# Altium schematic sheet 15 WIFI.SchDoc
size 420 x 297 mm
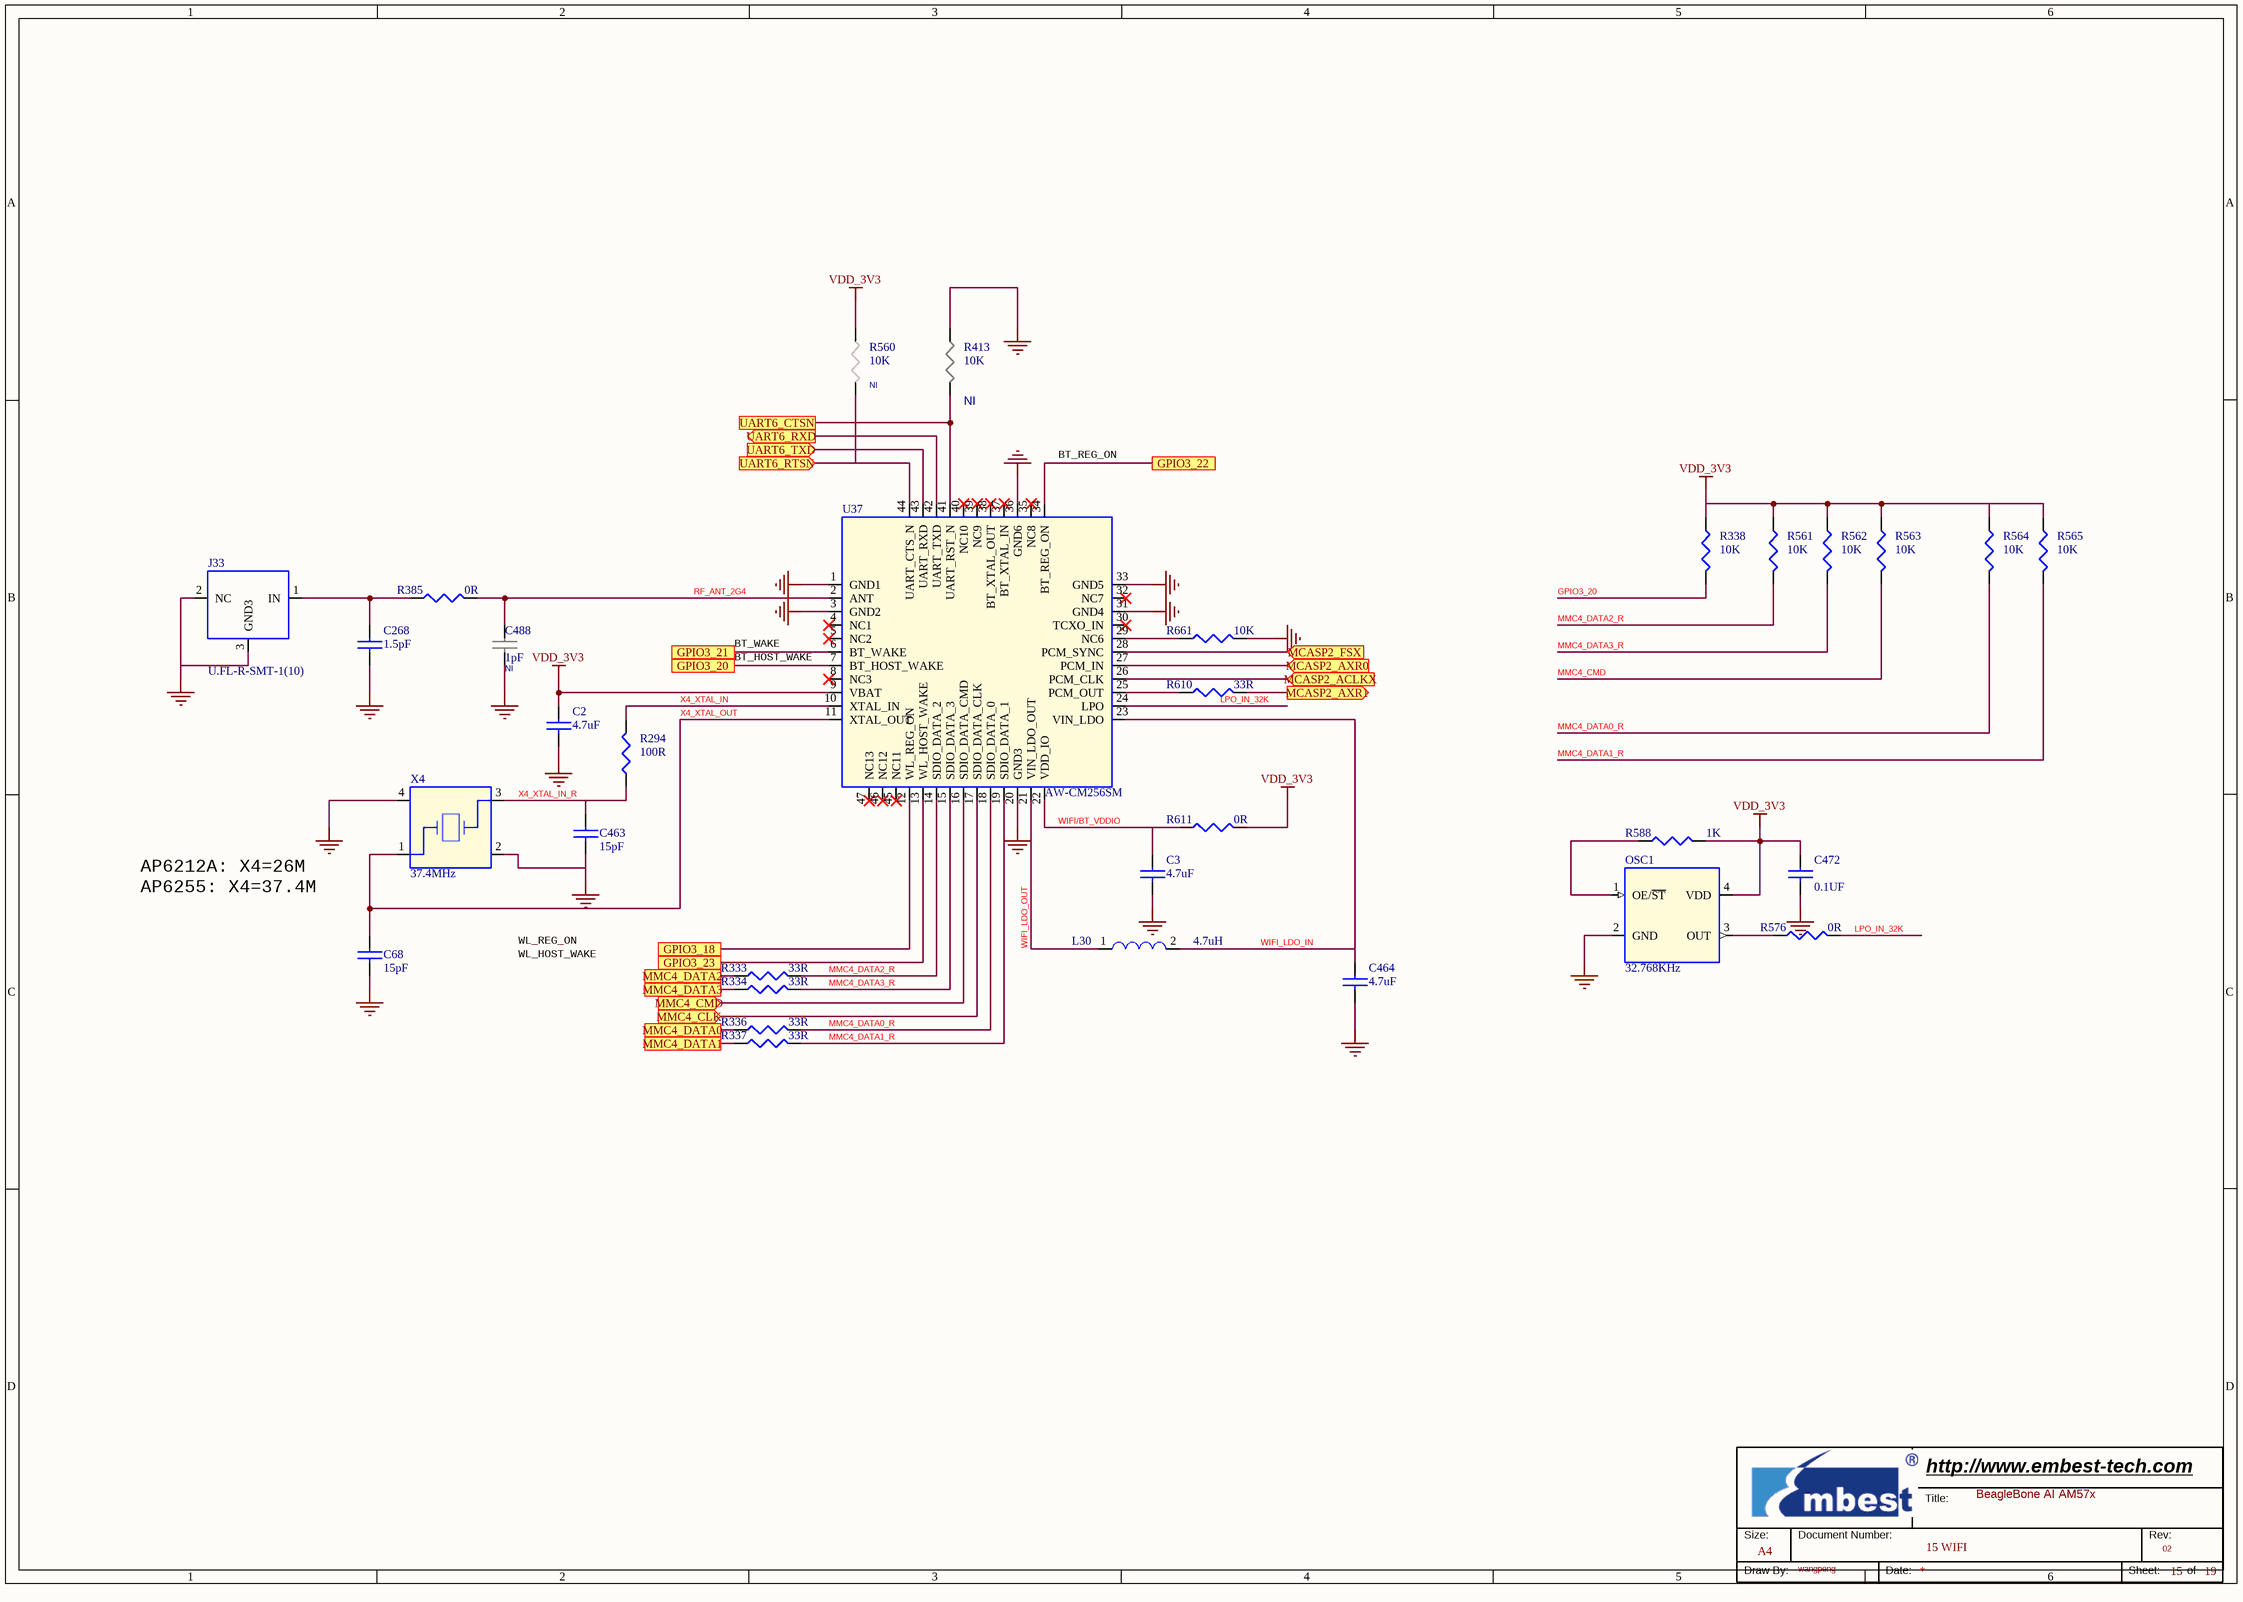
[diagram p0: 15 WIFI.SchDoc]

## Parts
*  Page Count: 19  Page Number: 15  Page Size: A4  Title: BeagleBone AI AM57x  RevCode: 02  Doc: 15 WIFI  Drawing: wangpeng  (hidden comment: Embest Title)  (graphical)
C2  4.7uF  [C0603]
C3  4.7uF  [C0603]
C68  15pF  [C0402]
C268  1.5pF  [C0402]
C463  15pF  [C0402]
C464  4.7uF  [C0603]
C472  0.1UF  [C0402]
C488  1pF  ASSY: NI  [C0402]
J33  U.FL-R-SMT-1(10)  [ANT3S_26X26]
L30  4.7uH  [L25X20]
OSC1  32.768KHz  [X4S25X20]
R294  100R  [R0402]
R333  33R  [R0402]
R334  33R  [R0402]
R336  33R  [R0402]
R337  33R  [R0402]
R338  10K  [R0402]
R385  0R  [R0402]
R413  10K  ASSY: NI  [R0402]
R560  10K  ASSY: NI  [R0402]
R561  10K  [R0402]
R562  10K  [R0402]
R563  10K  [R0402]
R564  10K  [R0402]
R565  10K  [R0402]
R576  0R  [R0402]
R588  1K  [R0402]
R610  33R  [R0402]
R611  0R  [R0402]
R661  10K  [R0402]
U37  AW-CM256SM  [WLBT90P1200X1200X160-47N]
X4  37.4MHz  [X4S16X12]

## Ports
GPIO3_18, GPIO3_20, GPIO3_21, GPIO3_22, GPIO3_23, MCASP2_ACLKX (in), MCASP2_AXR0 (in), MCASP2_AXR1 (out), MCASP2_FSX (in), MMC4_CLK (in), MMC4_CMD (in), MMC4_DATA0, MMC4_DATA1, MMC4_DATA2, MMC4_DATA3, UART6_CTSN, UART6_RTSN (in), UART6_RXD (out), UART6_TXD (in)

## Nets
GND: C2.2 C3.2 C68.2 C268.2 C463.2 C464.2 C472.2 C488.2 J33.2(NC) J33.3(GND3) OSC1.2(GND) R413.1 R661.2 U37.1(GND1) U37.3(GND2) U37.20(GND3) U37.31(GND4) U37.33(GND5) U37.36(GND6) X4.2 X4.4
VDD_3V3: C2.1 C472.1 OSC1.4(VDD) R338.1 R560.1 R561.1 R562.1 R563.1 R564.1 R565.1 R588.2 R611.2 U37.9(VBAT)
GPIO3_18: U37.12(WL_REG_ON) ; port GPIO3_18
GPIO3_20: R338.2
GPIO3_20: U37.7(BT_HOST_WAKE) ; port GPIO3_20  [a separate net that carries the same name]
GPIO3_21: U37.6(BT_WAKE) ; port GPIO3_21
GPIO3_22: U37.34(BT_REG_ON) ; port GPIO3_22
GPIO3_23: U37.13(WL_HOST_WAKE) ; port GPIO3_23
LPO_IN_32K: R576.2 U37.24(LPO)
MCASP2_ACLKX: U37.26(PCM_CLK) ; port MCASP2_ACLKX
MCASP2_AXR0: U37.27(PCM_IN) ; port MCASP2_AXR0
MCASP2_AXR1: R610.2 ; port MCASP2_AXR1
MCASP2_FSX: U37.28(PCM_SYNC) ; port MCASP2_FSX
MMC4_CLK: U37.17(SDIO_DATA_CLK) ; port MMC4_CLK
MMC4_CMD: R563.2
MMC4_CMD: U37.16(SDIO_DATA_CMD) ; port MMC4_CMD  [a separate net that carries the same name]
MMC4_DATA0: R336.1 ; port MMC4_DATA0
MMC4_DATA0_R: R336.2 R564.2 U37.18(SDIO_DATA_0)
MMC4_DATA1: R337.1 ; port MMC4_DATA1
MMC4_DATA1_R: R337.2 R565.2 U37.19(SDIO_DATA_1)
MMC4_DATA2: R333.1 ; port MMC4_DATA2
MMC4_DATA2_R: R333.2 R561.2 U37.14(SDIO_DATA_2)
MMC4_DATA3: R334.1 ; port MMC4_DATA3
MMC4_DATA3_R: R334.2 R562.2 U37.15(SDIO_DATA_3)
RF_ANT_2G4: C488.1 R385.2 U37.2(ANT)
UART6_CTSN: R413.2 U37.41(UART_RST_N) ; port UART6_CTSN
UART6_RTSN: R560.2 U37.44(UART_CTS_N) ; port UART6_RTSN
UART6_RXD: U37.42(UART_TXD) ; port UART6_RXD
UART6_TXD: U37.43(UART_RXD) ; port UART6_TXD
WIFI/BT_VDDIO: C3.1 R611.1 U37.22(VDD_IO)
WIFI_LDO_IN: C464.1 L30.2 U37.23(VIN_LDO)
WIFI_LDO_OUT: L30.1 U37.21(VIN_LDO_OUT)
X4_XTAL_IN: R294.2 U37.10(XTAL_IN)
X4_XTAL_IN_R: C463.1 R294.1 X4.3
X4_XTAL_OUT: C68.1 U37.11(XTAL_OUT) X4.1
NetC268_1: C268.1 J33.1(IN) R385.1
NetOSC1_1: OSC1.1(OE/~{ST}) R588.1
NetOSC1_3: OSC1.3(OUT) R576.1
NetR610_1: R610.1 U37.25(PCM_OUT)
NetR661_1: R661.1 U37.29(NC6)

Not connected (* = marked no-connect by the designer): U37 4(NC1)* 5(NC2)* 8(NC3)* 30(TCXO_IN)* 32(NC7)* 35(NC8)* 37(BT_XTAL_IN)* 38(BT_XTAL_OUT)* 39(NC9)* 40(NC10)* 45(NC11)* 46(NC12)* 47(NC13)*

## Notes on the sheet
- BT_REG_ON
- BT_WAKE
- (near U37) BT_HOST_WAKE
- AP6212A: X4=26M
  AP6255: X4=37.4M
- WL_REG_ON
- WL_HOST_WAKE
- (in symbol Embest Title) Title:; Size:; Document Number:; Rev:; Draw By:; Date:; Sheet:; of

## Library data of the parts
C2 = C: CAP,4.7UF,+/-10%,X5R,10V,SMD0603; Manufacturer Part Number: GRM188R61A475KE15D; Manufacturer: Murata; Embest PN: 1004001100126; Part Type: Ceramic Capacitor
C3 C464 = C: CAP,4.7UF,+/-10%,X5R,10V,SMD0603; Manufacturer: Murata; Manufacturer Part Number: GRM188R61A475KE15D; Embest PN: 1004001100126; Part Type: Ceramic Capacitor
C68 C463 = C: CAP,15pF,+/-2%,C0G,50V,SMD0402; Manufacturer Part Number: GRM1555C1H150GA01D; Manufacturer: Murata; Embest PN: 1004001100319; Datasheet: Y:\ÐÂK3ÏµÍ³ÎïÁÏdatasheet\[1003_1004]capacitor-resistor µçÈÝ¡¢µç×è\1004001100319 GRM1555C1H150GA01DMurata.pdf; Part Type: Ceramic Capacitor
C268 = C: Cap  Ceramic 1.5pF, +-0.25pF, 50V, C0G, 0402; Manufacturer: Murata; Manufacturer Part Number: GRM1555C1H1R5CA01D; Embest PN: 1004001100401; Part Type: Ceramic Capacitor
C472 = C: CAP,100NF,+/-10%,X7R,16V,SMD0402; Manufacturer Part Number: GRM155R71C104KA88D; Manufacturer: Murata; Embest PN: 1004001100047; Datasheet: Y:\ÐÂK3ÏµÍ³ÎïÁÏdatasheet\[1003_1004]capacitor-resistor µçÈÝ¡¢µç×è\1004001100047-GRM155R71C104KA88D.pdf; Part Type: Ceramic Capacitor
C488 = C: CAP,1.0PF,+/-0.1PF,50V,SMD0402,LowESR,High-Q type; Manufacturer Part Number: GJM1555C1H1R0BB01D; Manufacturer: Murata; Embest PN: 1004001100306; Datasheet: Y:\ÐÂK3ÏµÍ³ÎïÁÏdatasheet\[1003_1004]capacitor-resistor µçÈÝ¡¢µç×è\1004001100306 GJM1555C1H1R0BB01D murata.pdf; Part Type: Ceramic Capacitor
J33 = ANT3P: Connector,Coaxial Connector,U.FL-R-SMT-1,6GHZ,SMD,TR  U.FL-R-SMT-1(10) Packing for2,500 pcs/reel or U.FL-R-SMT-1(40) Packing for4,000 pcs/reel; Manufacturer: HIROSE; Embest PN: 1009019100014; Part Type: RF CONNECTOR; Manufacturer Part Number: U.FL-R-SMT-1(10); Datasheet: Y:\ÐÂK3ÏµÍ³ÎïÁÏdatasheet\[1009]connectors Á¬½ÓÆ÷\1009019100014 U.FL-R-SMT-1(10) hirose.pdf
L30 = L: Power Inductor,Magnetic shielded,4.7uH,1.05A,0.338ohm,2.5x2.0x1.2mm,SMD; Manufacturer: TDK; Manufacturer Part Number: VLS252012ET-4R7M; Embest PN: 1005004100057; Part Type: Power Inductor; Datasheet: Y:\ÐÂK3ÏµÍ³ÎïÁÏdatasheet\[1005]beads-inductors ´ÅÖé¡¢µç¸Ð\1005004100057_VLS252012ET_TDK.pdf
OSC1 = OSC-4: Oscillator,1651-L3273-BTBQYA,32.768KHz,+/-30ppm,3.3V,2520-4 pads,SMD; Manufacturer: INTERQUIP; Rating: 30PPM; Embest PN: 1008001100120; Status: BeagleBone AI; Manufacturer Part Number: 1651-L3273-BTBQYA; Part Type: Oscillator
R294 = R: RES,100R,+/-1%,1/16W,SMD0402,ALT_CODE:15052701; Manufacturer: YAGEO; Manufacturer Part Number: RC0402FR-07100RL; Embest PN: 1003001100019; Part Type: Thick film Resistor
R333 R336 R610 = R: RES,33R,+/-5%,1/16W,SMD0402; Manufacturer Part Number: RC0402JR-0733RL; Manufacturer: YAGEO; Embest PN: 1003001100010; Part Type: Thick film Resistor
R334 R337 = R: RES,33R,+/-5%,1/16W,SMD0402; Manufacturer: YAGEO; Manufacturer Part Number: RC0402JR-0733RL; Embest PN: 1003001100010; Part Type: Thick film Resistor
R338 R413 R561-R565 = R: RES,10K,+/-1%,1/16W,SMD0402; Manufacturer: YAGEO; Manufacturer Part Number: RC0402FR-0710KL; Embest PN: 1003001100071; Part Type: Thick film Resistor
R385 R611 = R: RES,0R,+/-5%,1/16W,SMD0402; Manufacturer: YAGEO; Manufacturer Part Number: RC0402JR-070RL; Embest PN: 1003001100001; Part Type: Thick film Resistor
R560 = R: RES,10K,+/-1%,1/16W,SMD0402; Manufacturer Part Number: RC0402FR-0710KL; Manufacturer: YAGEO; Embest PN: 1003001100071; Part Type: Thick film Resistor
R576 = R: RES,0R,+/-5%,1/16W,SMD0402; Manufacturer Part Number: RC0402JR-070RL; Manufacturer: YAGEO; Embest PN: 1003001100001; Part Type: Thick film Resistor
R588 = R: RES,1K,+/-5%,1/16W,SMD0402; Manufacturer Part Number: RC0402JR-071KL; Manufacturer: YAGEO; Embest PN: 1003001100035; Part Type: Thick film Resistor
R661 = R: RES,10K,+/-5%,1/16W,SMD0402; Manufacturer: YAGEO; Manufacturer Part Number: RC0402JR-0710KL; Embest PN: 1003001100072; Part Type: Thick film Resistor
U37 = AP6255: IEEE 802.11 a/b/g/n/ac WIFI with Bluetooth 4.2 combo SDIO and UART Stamp Module,AW-CM256SM,SMD; Manufacturer: AzureWave; Embest PN: 1105002000038; Datasheet: Y:\ÐÂK3ÏµÍ³ÎïÁÏdatasheet\[1016_1101_1106~9]packing_accessories°ü²Ä_¸¨ÁÏ_Åä¼þ\1105001200006 AP6255+datasheet_V1.5_05112017.pdf; Status: BeagleBone AI; Manufacturer Part Number: AW-CM256SM; Part Type: Wi-fi Module
X4 = X4: XTAL,37.4MHz,12PF 1.6x1.2mm,,X37M400000S002, SMT TR; Manufacturer: AEL; Embest PN: 1008002100155; Datasheet: Y:\ÐÂK3ÏµÍ³ÎïÁÏdatasheet\[1008]crystal ¾§Ìå\1008002100155  X37M400000S002.pdf; Manufacturer Part Number: X37M400000S002; Part Type: Crystal
* = Embest Title: Page Create Date: May 29, 2006; WebSite: http://www.embest-tech.com; Company: Embest; Page Modify Date: *